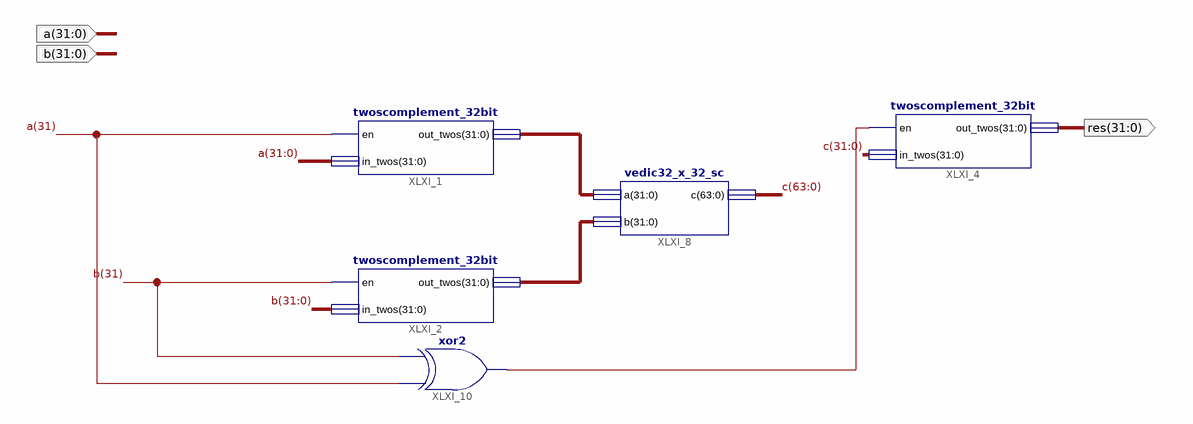
[diagram p0: schematic sheet 1]
// Xilinx ISE schematic vedic32_x_32_signed_sc.sch (spartan6) as structural Verilog: 5 symbols, 3 ports
module vedic32_x_32_signed_sc (
  input  [31:0] a,
  input  [31:0] b,
  output [31:0] res
);

  wire XLXN_16;
  wire [31:0] XLXN_7, XLXN_9;
  wire [63:0] c;

  twoscomplement_32bit XLXI_1 (.en(a[31]), .in_twos(a), .out_twos(XLXN_7));
  twoscomplement_32bit XLXI_2 (.en(b[31]), .in_twos(b), .out_twos(XLXN_9));
  twoscomplement_32bit XLXI_4 (.en(XLXN_16), .in_twos(c[31:0]), .out_twos(res));
  vedic32_x_32_sc XLXI_8 (.a(XLXN_7), .b(XLXN_9), .c(c));
  xor XLXI_10 (XLXN_16, a[31], b[31]);
endmodule
